# EAGLE design JTAG20F-JTAG10M (EAGLE 6.4)
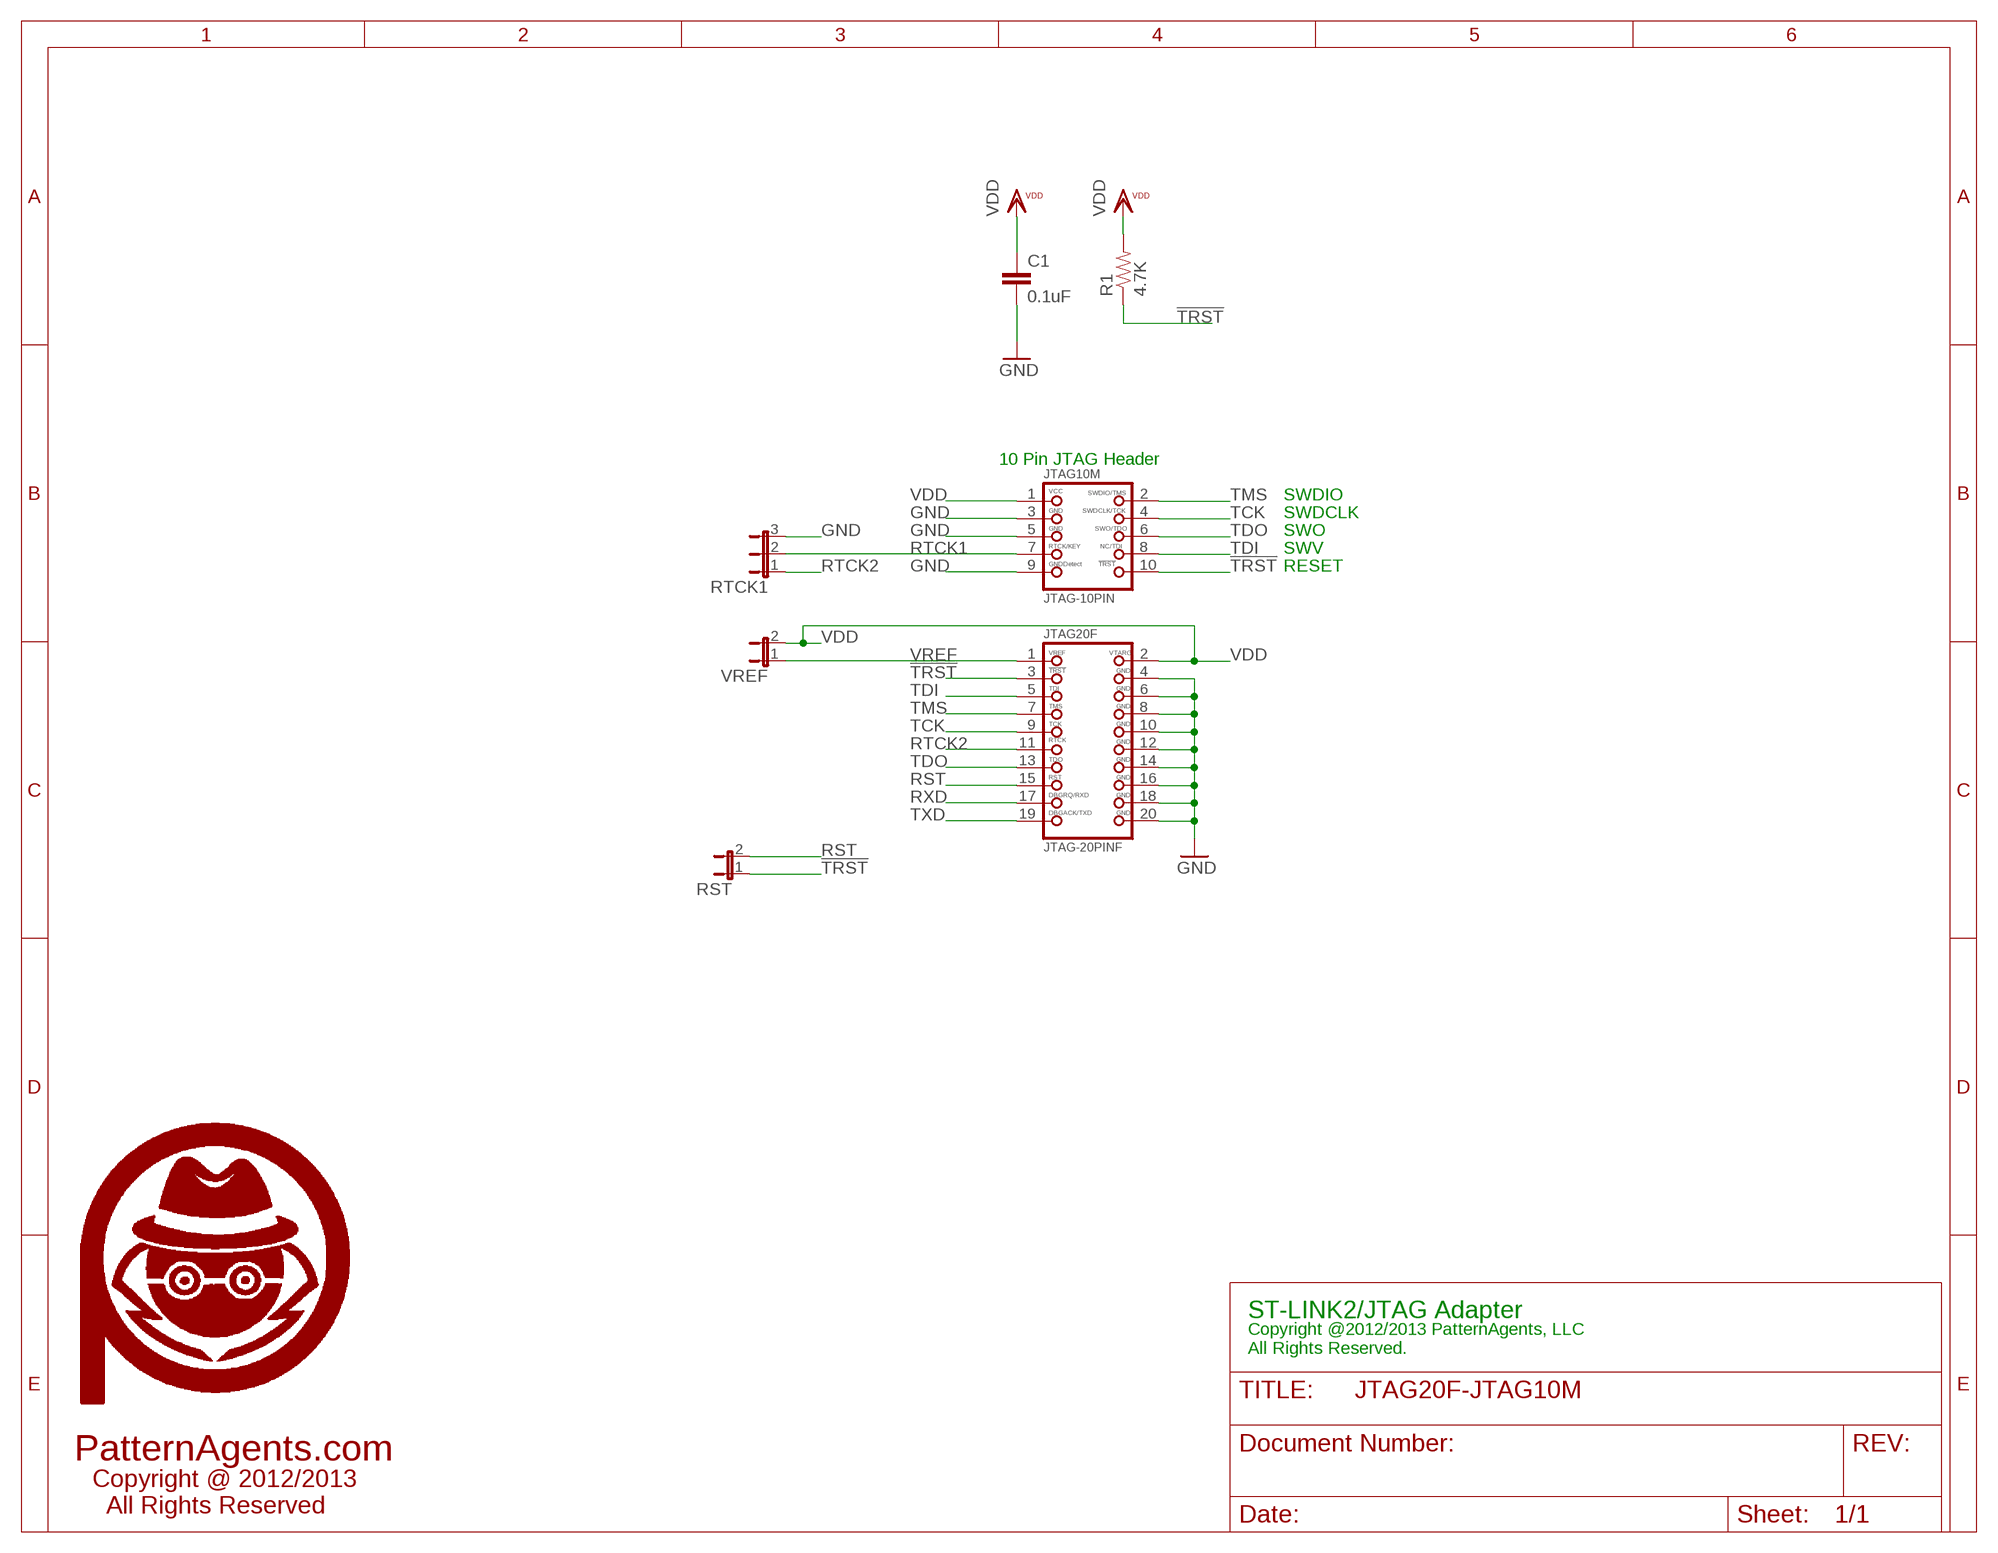
[diagram p0: schematic, sheet 1]

## Parts
C1  0.1uF  CAP0603-CAP  [0603-CAP]
JTAG10M  JTAG-10PIN  JTAG-10PINSMD  [2X05_1.27MM_SMT]
JTAG20F  JTAG-20PINF  [2X10F_2.54MM_PTH]
R1  4.7K  RESISTOR_SFE0603-RES  [0603-RES]
RST  JUMPER2  [JUMPER2]
RTCK1  JUMPER3  [JUMPER3]
U$2  PA_LOGO_SYMLARGE  [PA_LOGO_AGENT_LRG_SYM]
VREF  JUMPER2  [JUMPER2]

## Nets
!TRST: JTAG10M.10 JTAG20F.3 R1.1 RST.1
GND: C1.2 JTAG10M.3 JTAG10M.5 JTAG10M.9 JTAG20F.4 JTAG20F.6 JTAG20F.8 JTAG20F.10 JTAG20F.12 JTAG20F.14 JTAG20F.16 JTAG20F.18 JTAG20F.20 RTCK1.3
RST: JTAG20F.15 RST.2
RTCK1: JTAG10M.7 RTCK1.2
RTCK2: JTAG20F.11 RTCK1.1
RXD: JTAG20F.17
TCK: JTAG10M.4 JTAG20F.9
TDI: JTAG10M.8 JTAG20F.5
TDO: JTAG10M.6 JTAG20F.13
TMS: JTAG10M.2 JTAG20F.7
TXD: JTAG20F.19
VDD: C1.1 JTAG10M.1 JTAG20F.2 R1.2 VREF.2
VREF: JTAG20F.1 VREF.1

## Notes on the sheet
- 10 Pin JTAG Header
- SWDIO
- SWDCLK
- SWO
- SWV
- RESET
- ST-LINK2/JTAG Adapter
- Copyright @2012/2013 PatternAgents, LLC
  All Rights Reserved.
- PatternAgents.com
- Copyright @ 2012/2013
    All Rights Reserved

## Library data of the parts
C1 = PatternAgents-Misc:CAP: Capacitor Standard 0603 ceramic capacitor, and 0.1" leaded capacitor.
JTAG10M = PatternAgents_JTAG:JTAG-10PIN: JTAG 10 Pin (SWD) Programming Connector LBR Source: http://www.patternagents.com THIS SOFTWARE IS PROVIDED BY THE CONTRIBUTORS "AS IS" AND WITHOUT ANY EXPRESS OR IMPLIED WARRANTIES, INCLUDING, BUT NOT LIMITED TO, THE IMPLIED WARRANTIES OF MERCHANTABILITY AND FITNESS FOR A PARTICULAR PURPOSE ARE DISCLAIMED. IN NO EVENT SHALL THE COPYRIGHT OWNER OR CONTRIBUTORS BE LIABLE FOR ANY DIRECT, INDIRECT, INCIDENTAL, SPECIAL, EXEMPLARY, OR CONSEQUENTIAL DAMAGES (INCLUDING, BUT NOT LIMITED TO, PROCUREMENT OF SUBSTITUTE GOODS OR SERVICES; LOSS OF USE, DATA, OR PROFITS; OR BUSINESS INTERRUPTION) HOWEVER CAUSED AND ON ANY THEORY OF LIABILITY, WHETHER IN CONTRACT, STRICT LIABILITY, OR TORT (INCLUDING NEGLIGENCE OR OTHERWISE) ARISING IN ANY WAY OUT OF THE USE OF THIS SOFTWARE, EVEN IF ADVISED OF THE POSSIBILITY OF SUCH DAMAGE.
JTAG20F = PatternAgents-JTAG:JTAG-20PIN: JTAG 20 Pin Programming Connector LBR Source: http://www.patternagents.com THIS SOFTWARE IS PROVIDED BY THE CONTRIBUTORS "AS IS" AND WITHOUT ANY EXPRESS OR IMPLIED WARRANTIES, INCLUDING, BUT NOT LIMITED TO, THE IMPLIED WARRANTIES OF MERCHANTABILITY AND FITNESS FOR A PARTICULAR PURPOSE ARE DISCLAIMED. IN NO EVENT SHALL THE COPYRIGHT OWNER OR CONTRIBUTORS BE LIABLE FOR ANY DIRECT, INDIRECT, INCIDENTAL, SPECIAL, EXEMPLARY, OR CONSEQUENTIAL DAMAGES (INCLUDING, BUT NOT LIMITED TO, PROCUREMENT OF SUBSTITUTE GOODS OR SERVICES; LOSS OF USE, DATA, OR PROFITS; OR BUSINESS INTERRUPTION) HOWEVER CAUSED AND ON ANY THEORY OF LIABILITY, WHETHER IN CONTRACT, STRICT LIABILITY, OR TORT (INCLUDING NEGLIGENCE OR OTHERWISE) ARISING IN ANY WAY OUT OF THE USE OF THIS SOFTWARE, EVEN IF ADVISED OF THE POSSIBILITY OF SUCH DAMAGE.
R1 = PatternAgents-Misc:RESISTOR_SFE: Resistor Basic schematic elements and footprints for 0603, 1206, and PTH resistors.
RST VREF = PatternAgents_JTAG:JUMPER2: Jumper 2 Pin LBR Source: http://www.patternagents.com THIS SOFTWARE IS PROVIDED BY THE CONTRIBUTORS "AS IS" AND WITHOUT ANY EXPRESS OR IMPLIED WARRANTIES, INCLUDING, BUT NOT LIMITED TO, THE IMPLIED WARRANTIES OF MERCHANTABILITY AND FITNESS FOR A PARTICULAR PURPOSE ARE DISCLAIMED. IN NO EVENT SHALL THE COPYRIGHT OWNER OR CONTRIBUTORS BE LIABLE FOR ANY DIRECT, INDIRECT, INCIDENTAL, SPECIAL, EXEMPLARY, OR CONSEQUENTIAL DAMAGES (INCLUDING, BUT NOT LIMITED TO, PROCUREMENT OF SUBSTITUTE GOODS OR SERVICES; LOSS OF USE, DATA, OR PROFITS; OR BUSINESS INTERRUPTION) HOWEVER CAUSED AND ON ANY THEORY OF LIABILITY, WHETHER IN CONTRACT, STRICT LIABILITY, OR TORT (INCLUDING NEGLIGENCE OR OTHERWISE) ARISING IN ANY WAY OUT OF THE USE OF THIS SOFTWARE, EVEN IF ADVISED OF THE POSSIBILITY OF SUCH DAMAGE.
RTCK1 = PatternAgents_JTAG:JUMPER3: Jumper 3 Pin LBR Source: http://www.patternagents.com THIS SOFTWARE IS PROVIDED BY THE CONTRIBUTORS "AS IS" AND WITHOUT ANY EXPRESS OR IMPLIED WARRANTIES, INCLUDING, BUT NOT LIMITED TO, THE IMPLIED WARRANTIES OF MERCHANTABILITY AND FITNESS FOR A PARTICULAR PURPOSE ARE DISCLAIMED. IN NO EVENT SHALL THE COPYRIGHT OWNER OR CONTRIBUTORS BE LIABLE FOR ANY DIRECT, INDIRECT, INCIDENTAL, SPECIAL, EXEMPLARY, OR CONSEQUENTIAL DAMAGES (INCLUDING, BUT NOT LIMITED TO, PROCUREMENT OF SUBSTITUTE GOODS OR SERVICES; LOSS OF USE, DATA, OR PROFITS; OR BUSINESS INTERRUPTION) HOWEVER CAUSED AND ON ANY THEORY OF LIABILITY, WHETHER IN CONTRACT, STRICT LIABILITY, OR TORT (INCLUDING NEGLIGENCE OR OTHERWISE) ARISING IN ANY WAY OUT OF THE USE OF THIS SOFTWARE, EVEN IF ADVISED OF THE POSSIBILITY OF SUCH DAMAGE.
U$2 = PatternAgents-Logos:PA_LOGO_SYM: PatternAgents Logo Symbol Trademark : PatternAgents, LLC Github : https://github.com/PatternAgents/PCB_Libraries License : http://creativecommons.org/licenses/by-sa/3.0/ (Creative Commons 3.0) THIS SOFTWARE IS PROVIDED BY THE CONTRIBUTORS "AS IS" AND WITHOUT ANY EXPRESS OR IMPLIED WARRANTIES, INCLUDING, BUT NOT LIMITED TO, THE IMPLIED WARRANTIES OF MERCHANTABILITY AND FITNESS FOR A PARTICULAR PURPOSE ARE DISCLAIMED. IN NO EVENT SHALL THE COPYRIGHT OWNER OR CONTRIBUTORS BE LIABLE FOR ANY DIRECT, INDIRECT, INCIDENTAL, SPECIAL, EXEMPLARY, OR CONSEQUENTIAL DAMAGES (INCLUDING, BUT NOT LIMITED TO, PROCUREMENT OF SUBSTITUTE GOODS OR SERVICES; LOSS OF USE, DATA, OR PROFITS; OR BUSINESS INTERRUPTION) HOWEVER CAUSED AND ON ANY THEORY OF LIABILITY, WHETHER IN CONTRACT, STRICT LIABILITY, OR TORT (INCLUDING NEGLIGENCE OR OTHERWISE) ARISING IN ANY WAY OUT OF THE USE OF THIS SOFTWARE, EVEN IF ADVISED OF THE POSSIBILITY OF SUCH DAMAGE.

## Board
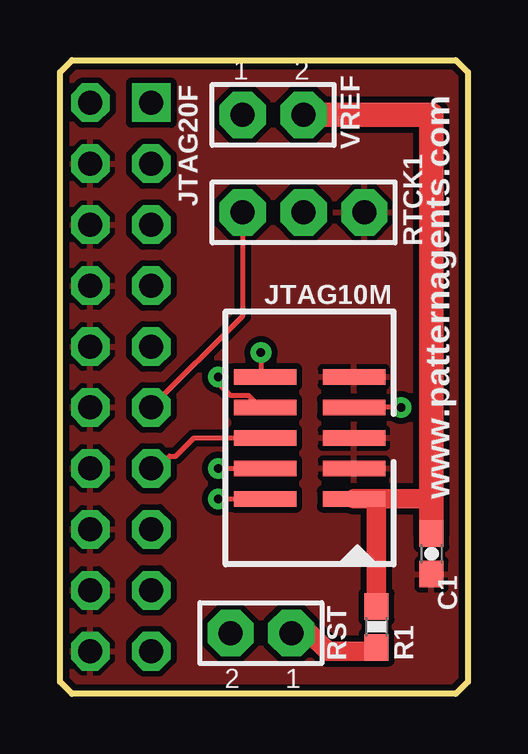
[diagram p1: board, top side]
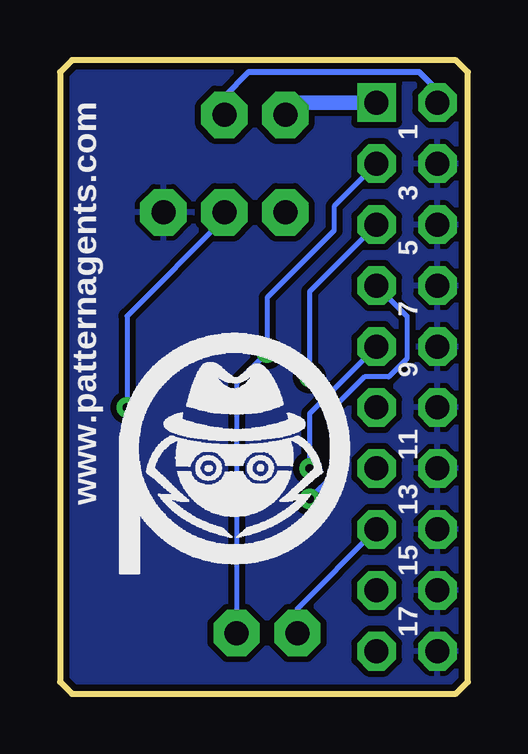
[diagram p2: board, bottom side, seen from below]

Size 17.02 x 26.42 mm. Coordinates in mm from the lower left corner, seen from the top.
Outline: 0,0.51 0,25.91 0.51,26.42 16.51,26.42 17.02,25.91 17.02,0.51 16.51,0 0.51,0 0,0.51
Copper layers (1*16): Top 0.035mm / dielectric 1.5mm / Bottom 0.035mm
Design rules "PatternAgents": minimum track width 8mil, minimum drill 14mil, track to track 8mil, track to pad 8mil, pad to pad 8mil, via to via 8mil, smd to smd 8mil, copper to edge 10mil, drill to drill 8mil, minimum pad ring 12mil, minimum via ring 10mil, stop-mask expansion 4mil, vias tented up to drill 25mil, thermal gap 8mil

### Footprints (pad centres in the part's own frame; a part is rotated, then mirrored left to right if it is on the bottom)
0603-CAP = smd 1.1 x 1: 1 -0.85,0; 2 0.85,0
2X05_1.27MM_SMT = smd 0.65 x 2.6: 1 -2.54,-1.85; 2 -2.54,1.85; 3 -1.27,-1.85; 4 -1.27,1.85; 5 0,-1.85; 6 0,1.85; 7 1.27,-1.85; 8 1.27,1.85; 9 2.54,-1.85; 10 2.54,1.85
2X10F_2.54MM_PTH = drill 1 square: 1 -11.43,-1.27 | drill 1 octagon: 2 -11.43,1.27; 3 -8.89,-1.27; 4 -8.89,1.27; 5 -6.35,-1.27; 6 -6.35,1.27; 7 -3.81,-1.27; 8 -3.81,1.27; 9 -1.27,-1.27; 10 -1.27,1.27; 11 1.27,-1.27; 12 1.27,1.27; 13 3.81,-1.27; 14 3.81,1.27; 15 6.35,-1.27; 16 6.35,1.27; 17 8.89,-1.27; 18 8.89,1.27; 19 11.43,-1.27; 20 11.43,1.27
0603-RES = smd 1.1 x 1: 1 -0.85,0; 2 0.85,0
JUMPER2 = drill 1 pad 1.93 octagon: 1 2.54,0; 2 0,0
JUMPER3 = drill 1 pad 1.93 octagon: 1 -2.54,0; 2 0,0; 3 2.54,0

### Placement (x,y rotation side)
C1  15.49,5.84 270 top
JTAG10M  10.41,10.67 90 top
JTAG20F  2.54,13.21 270 bottom
R1  13.21,2.79 90 top
RST  7.11,2.54 0 top
RTCK1  10.16,20.07 0 top
U$2  9.65,9.4 0 bottom
VREF  10.16,24.13 180 top

### Tracks (layer width: path | path; a pad name or v marks a point on that pad's centre or on a via)
!TRST  (via drill 0.36)
  Top 0.203: v8.38,14.22 8.38,13.21 JTAG10M.10
  Top 0.813: RST.1 10.41,2.54 11.18,1.78 13.04,1.78 R1.1
  Bottom 0.203: JTAG20F.3 5.59,20.32 5.59,19.3 8.38,16.51 v8.38,14.22 9.65,12.95 RST.1
GND
  pour Bottom (isolate 0.254): 0,0 0,26.42 17.02,26.42 17.02,0
  pour Top (isolate 0.254): 0,0 0,26.42 17.02,26.42 17.02,0
RST
  Bottom 0.203: JTAG20F.15 7.11,3.56 RST.2
RTCK1  (via drill 0.36)
  Top 0.203: v14.22,11.94 JTAG10M.7
  Bottom 0.203: v14.22,11.94 14.22,15.75 10.16,19.81 RTCK1.2
RTCK2
  Top 0.203: JTAG20F.11 7.62,15.75 RTCK1.1
TCK  (via drill 0.36)
  Top 0.203: v6.6,9.4 JTAG10M.4
  Bottom 0.203: v6.6,9.4 6.6,11.68 JTAG20F.9
TDI  (via drill 0.36)
  Top 0.203: v6.6,13.21 6.6,12.95 7.11,12.45 7.87,12.45 8.38,11.94 JTAG10M.8
  Bottom 0.203: v6.6,13.21 6.6,16.76 JTAG20F.5
TDO
  Top 0.203: JTAG10M.6 5.59,10.67 4.83,9.91 4.57,9.91 4.06,9.4 JTAG20F.13
TMS  (via drill 0.36)
  Top 0.203: v6.6,8.13 JTAG10M.2
  Bottom 0.203: v6.6,8.13 5.59,9.14 5.59,11.94 4.32,13.21 3.3,13.21 2.54,13.97 2.54,15.75 JTAG20F.7
VDD
  Top 0.813: JTAG10M.1 13.21,8.13 | 13.21,8.13 15.49,8.13 | R1.2 13.21,8.13
  Top 1.016: VREF.2 15.49,24.13 15.49,8.13 C1.1
  Bottom 0.254: JTAG20F.2 1.27,25.15 2.03,25.91 9.14,25.91 10.16,24.89 VREF.2
VREF
  Bottom 0.61: JTAG20F.1 7.11,24.64 VREF.1

### Text on the board
tPlace: www.patternagents.com
bPlace: www.patternagents.com